# Altium schematic sheet [05] - TK2560_OutputLEDs.SchDoc
size A4; SheetNumber: 6; SheetTotal: 15
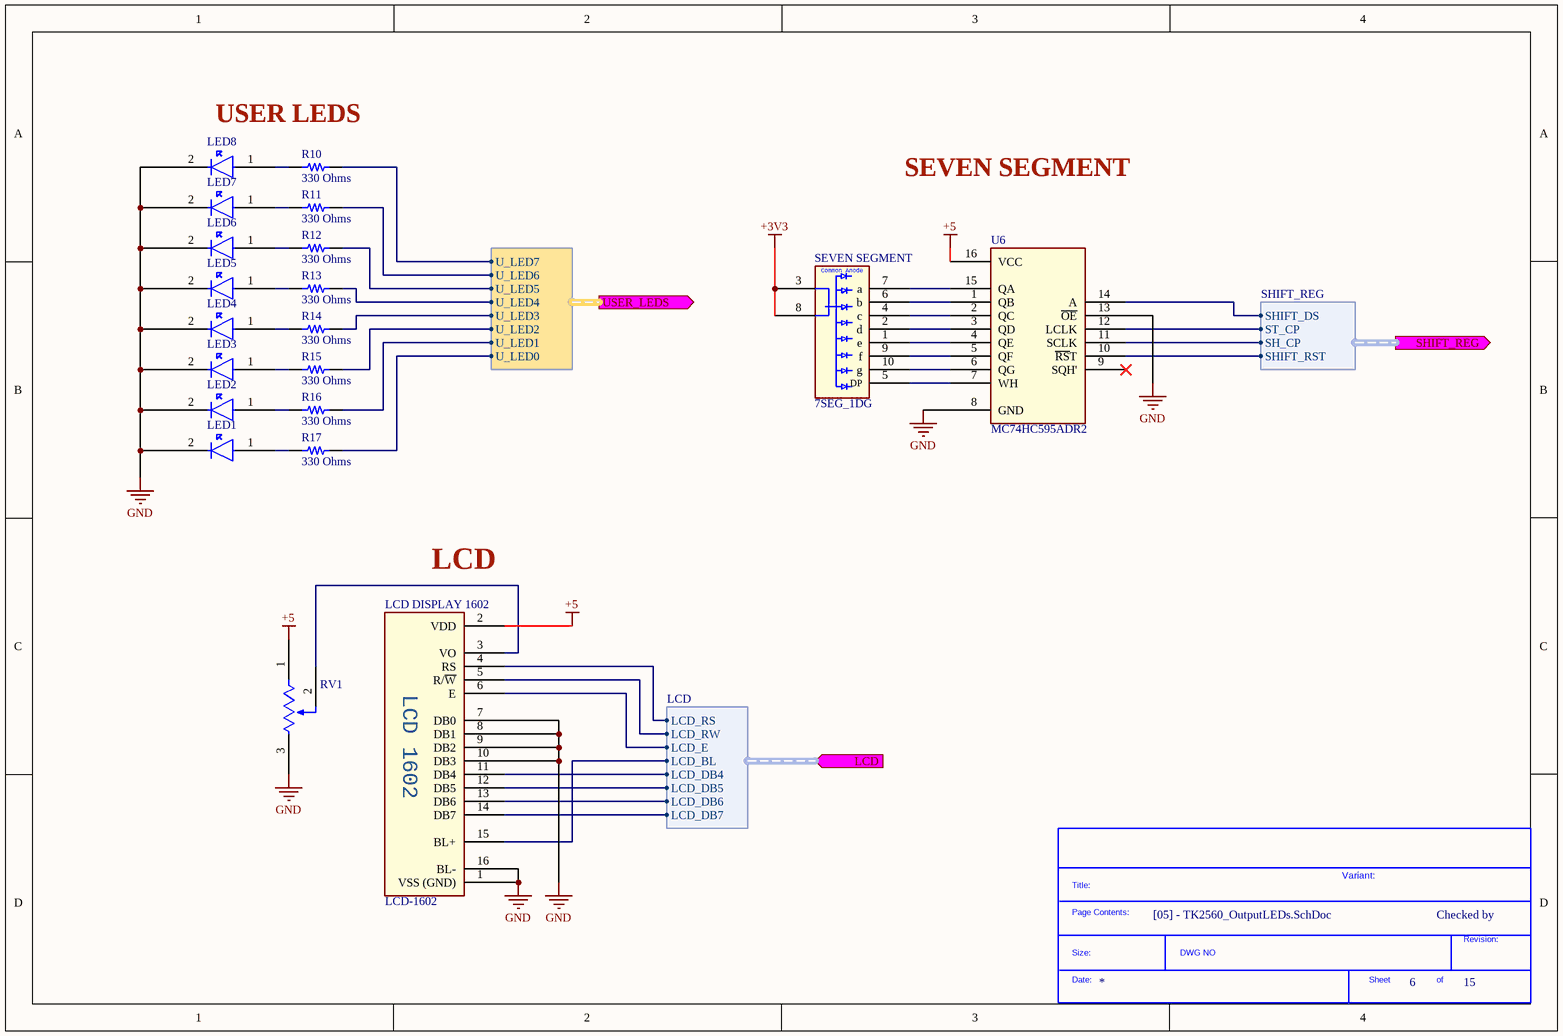
[diagram p0: [05] - TK2560_OutputLEDs.SchDoc]

## Parts
*?  SDTitleBlock  (value not drawn)  (graphical)
LCD_DISPLAY_1602  LCD-1602  [LCD1602]
LED1  LED_5mm  [LED_5mm]  (value not drawn)
LED2  LED_5mm  [LED_5mm]  (value not drawn)
LED3  LED_5mm  [LED_5mm]  (value not drawn)
LED4  LED_5mm  [LED_5mm]  (value not drawn)
LED5  LED_5mm  [LED_5mm]  (value not drawn)
LED6  LED_5mm  [LED_5mm]  (value not drawn)
LED7  LED_5mm  [LED_5mm]  (value not drawn)
LED8  LED_5mm  [LED_5mm]  (value not drawn)
R10  330 Ohms  [RES 0805_2012]
R11  330 Ohms  [RES 0805_2012]
R12  330 Ohms  [RES 0805_2012]
R13  330 Ohms  [RES 0805_2012]
R14  330 Ohms  [RES 0805_2012]
R15  330 Ohms  [RES 0805_2012]
R16  330 Ohms  [RES 0805_2012]
R17  330 Ohms  [RES 0805_2012]
RV1  3296W-10K_Trim_Pot  [3296W_TrimPot]  (value not drawn)
SEVEN_SEGMENT  7SEG_1DG  [7SEG_1DG]
U6  MC74HC595ADR2  [SOIC-16]

## Ports
LCD (in, harness LCD), SHIFT_REG (out, harness SHIFT_REG), USER_LEDS (out, harness USER_LEDS)

## Harnesses
LCD: LCD_RS, LCD_RW, LCD_E, LCD_BL, LCD_DB4, LCD_DB5, LCD_DB6, LCD_DB7
SHIFT_REG: SHIFT_RST, SH_CP, ST_CP, SHIFT_DS
USER_LEDS: U_LED0, U_LED1, U_LED2, U_LED3, U_LED4, U_LED5, U_LED6, U_LED7

## Nets
+3V3: SEVEN_SEGMENT.3 SEVEN_SEGMENT.8
+5: LCD_DISPLAY_1602.2(VDD) RV1.1 U6.16(VCC)
GND: LCD_DISPLAY_1602.1(VSS_(GND)) LCD_DISPLAY_1602.7(DB0) LCD_DISPLAY_1602.8(DB1) LCD_DISPLAY_1602.9(DB2) LCD_DISPLAY_1602.10(DB3) LCD_DISPLAY_1602.16(BL-) LED1.2 LED2.2 LED3.2 LED4.2 LED5.2 LED6.2 LED7.2 LED8.2 RV1.3 U6.8(GND) U6.13(~{OE})
NetLCD_DISPLAY_1602_3: LCD_DISPLAY_1602.3(VO) RV1.2
NetLCD_DISPLAY_1602_4: LCD_DISPLAY_1602.4(RS) ; port LCD.LCD_RS
NetLCD_DISPLAY_1602_5: LCD_DISPLAY_1602.5(R/~{W}) ; port LCD.LCD_RW
NetLCD_DISPLAY_1602_6: LCD_DISPLAY_1602.6(E) ; port LCD.LCD_E
NetLCD_DISPLAY_1602_11: LCD_DISPLAY_1602.11(DB4) ; port LCD.LCD_DB4
NetLCD_DISPLAY_1602_12: LCD_DISPLAY_1602.12(DB5) ; port LCD.LCD_DB5
NetLCD_DISPLAY_1602_13: LCD_DISPLAY_1602.13(DB6) ; port LCD.LCD_DB6
NetLCD_DISPLAY_1602_14: LCD_DISPLAY_1602.14(DB7) ; port LCD.LCD_DB7
NetLCD_DISPLAY_1602_15: LCD_DISPLAY_1602.15(BL+) ; port LCD.LCD_BL
NetLED1_1: LED1.1 R17.1
NetLED2_1: LED2.1 R16.1
NetLED3_1: LED3.1 R15.1
NetLED4_1: LED4.1 R14.1
NetLED5_1: LED5.1 R13.1
NetLED6_1: LED6.1 R12.1
NetLED7_1: LED7.1 R11.1
NetLED8_1: LED8.1 R10.1
NetR10_2: R10.2 ; port USER_LEDS.U_LED7
NetR11_2: R11.2 ; port USER_LEDS.U_LED6
NetR12_2: R12.2 ; port USER_LEDS.U_LED5
NetR13_2: R13.2 ; port USER_LEDS.U_LED4
NetR14_2: R14.2 ; port USER_LEDS.U_LED3
NetR15_2: R15.2 ; port USER_LEDS.U_LED2
NetR16_2: R16.2 ; port USER_LEDS.U_LED1
NetR17_2: R17.2 ; port USER_LEDS.U_LED0
NetSEVEN_SEGMENT_1: SEVEN_SEGMENT.1(e) U6.4(QE)
NetSEVEN_SEGMENT_2: SEVEN_SEGMENT.2(d) U6.3(QD)
NetSEVEN_SEGMENT_4: SEVEN_SEGMENT.4(c) U6.2(QC)
NetSEVEN_SEGMENT_5: SEVEN_SEGMENT.5(DP) U6.7(WH)
NetSEVEN_SEGMENT_6: SEVEN_SEGMENT.6(b) U6.1(QB)
NetSEVEN_SEGMENT_7: SEVEN_SEGMENT.7(a) U6.15(QA)
NetSEVEN_SEGMENT_9: SEVEN_SEGMENT.9(f) U6.5(QF)
NetSEVEN_SEGMENT_10: SEVEN_SEGMENT.10(g) U6.6(QG)
NetU6_10: U6.10(~{RS}T) ; port SHIFT_REG.SHIFT_RST
NetU6_11: U6.11(SCLK) ; port SHIFT_REG.SH_CP
NetU6_12: U6.12(LCLK) ; port SHIFT_REG.ST_CP
NetU6_14: U6.14(A) ; port SHIFT_REG.SHIFT_DS

Not connected (* = marked no-connect by the designer): U6 9(SQH')*

## Notes on the sheet
- USER LEDS
- SEVEN SEGMENT
- (near LCD_DISPLAY_1602) LCD
- Variant:
- Checked by
- (in symbol LCD-1602) LCD 1602
- (in symbol SDTitleBlock) Title:; Page Contents:; Revision:; Size:; DWG NO; Date:; Sheet; of

## Library data of the parts
LCD_DISPLAY_1602 = LCD-1602: LUMEX         LCM-S01602DTR/C             Alphanumeric LCD, 16 x 2, Black on Grey, 5V, Parallel, English, Japanese, Reflective; Number of Characters: 32; Character Height: 5.56mm; Character Width: 2.96mm; Background Color: Green; Number Of Characters Per Row: 16; Current Rating: 3mA; Viewing Area (width): 66mm; Viewing Area (height): 16mm; Supplier 1: Digi-Key; Manufacturer: Lumex; Manufacturer Part Number: LCM-S01602DTR/C; RoHS: Yes; Category: LCD, OLED, Graphic Displays; Stock 1: 70; Pricing 1: 1=11.49000, 10=8.33200, 100=6.88450, 500=6.02938, 1000=5.70050, 2000=5.56895, 5000=5.48125, 10000=5.37163 (USD); Case/Package: Module; Min Operating Temperature: 0°C; Max Operating Temperature: 50°C; Interface: Parallel; Operating Supply Voltage: 5V; Packaging: Bulk; Package Quantity: 45; Voltage Rating: 5V; Length: 85mm; Width: 85mm; Height: 30mm; REACH SVHC: No SVHC; Lead Free: Lead Free; ComponentLink1URL: https://datasheet.ciiva.com/1314/1701289-1314455.pdf?src-supplier=Newark; ComponentLink1Description: https://datasheet.ciiva.com/1314/1701289-1314455.pdf?src-supplier=Newark; ComponentLink2URL: https://datasheet.ciiva.com/1227/1701289-1227260.pdf?src-supplier=Element14; ComponentLink2Description: https://datasheet.ciiva.com/1227/1701289-1227260.pdf?src-supplier=Element14; Supplier Part Number 1: 67-1780-ND
LED1-LED8 = LED_5mm: 5MM LED; Manufacturer: Kingbright; Manufacturer Part Number: WP7113ND; Stock 1: 50; Pricing 1: 1=0.67000, 10=0.41100, 100=0.23650, 1000=0.18508, 2000=0.16966, 5000=0.15423, 10000=0.14395, 25000=0.13881 (USD); Supplier 1: Digi-Key; Supplier Part Number 1: 754-1896-ND; ComponentLink1Description: Datasheet; ComponentLink1URL: https://www.kingbrightusa.com/images/catalog/SPEC/WP7113ND.pdf
R10-R17 = RC0805FR-07330RL: RES SMD 330 OHM 1% 1/8W 0805; Manufacturer: Yageo; Power (Watts): 0.125W, 1/8W; Temperature Coefficient: ±100ppm/°C; Part Number: RC0805FR-07330RL; Value: 330 Ohms; ComponentLink1Description: Datasheet; ComponentLink1URL: https://www.yageo.com/upload/media/product/productsearch/datasheet/rchip/PYu-RC_Group_51_RoHS_L_10.pdf; ComponentLink2Description: DigiKey Link; ComponentLink2URL: http://digikey.com/product-detail/en/yageo/RC0805FR-07330RL/311-330CRCT-ND/730813; Composition: Thick Film; Device Package: 0805 (2012 Metric); Features: Moisture Resistant; Height - Seated (Max): 0.024" (0.60mm); LastUpdated: 02/09/2020 01:15:14; Lifecycle Status: Active; Minimum Order: 1; Number of Terminations: 2; Operating Temperature: -55°C ~ 155°C; Package / Case: 0805 (2012 Metric); Packaging: CutTape; PartId: 32600; Part Status: Active; Price: 0.10; Resistance: 330 Ohms; Series: RC; Size / Dimension: 0.079" L x 0.049" W (2.00mm x 1.25mm); Supplier 1: DigiKey; Supplier Part Number 1: 311-330CRCT-ND; Supplier Device Package: 0805; Tolerance: ±1%
RV1 = 3296W-10K_Trim_Pot: TRIMMER 10K OHM 0.5W PC PIN TOP; Manufacturer: Bourns; Manufacturer Part Number: 3296W-1-103; Tolerance: 10%; Power Rating: 500mW; Resistance: 10kR; Number of Turns: 25; Temperature Coefficient: 100ppm/°C; Voltage Rating (DC): 500V; RoHS: No; Category: Variable Resistors and Potentiometers; Stock 1: 58; Pricing 1: 1=4.38000, 10=3.83600, 25=3.42520, 50=3.21960, 100=3.15100, 250=3.01400, 500=2.46600, 1000=2.12350, 5000=1.91800 (USD); Mount: PCB,Through Hole; Weight: 0.03oz; Color: Blue; Contact Plating: Tin,Lead; Min Operating Temperature: -55°C; Max Operating Temperature: 125°C; Package Quantity: 50; Packaging: Rail/Tube; Termination: Pin; Resistor Type: Cermet; Max Power Dissipation: 500mW; Taper: Linear; Series: Trimpot® 3296 - Sealed; Technology: CERMET; Resistance Tolerance: 10%; Length: 9.53mm; Width: 9.53mm; Height: 0.395inch; Depth: 4.83mm; Thickness: 5.59mm; Radiation Hardening: No; REACH SVHC: No SVHC; Military Standard: Not; RoHS Compliant: No; ComponentLink1URL: https://datasheet.ciiva.com/3266/3296-3266186.pdf?src-supplier=Avnet; ComponentLink1Description: https://datasheet.ciiva.com/3266/3296-3266186.pdf?src-supplier=Avnet; ComponentLink2URL: https://datasheet.ciiva.com/2164/3296-2164077.pdf?src-supplier=Digi-Key; ComponentLink2Description: https://datasheet.ciiva.com/2164/3296-2164077.pdf?src-supplier=Digi-Key; ComponentLink3URL: https://datasheet.ciiva.com/1570/1815117-1570414.pdf?src-supplier=Newark; ComponentLink3Description: https://datasheet.ciiva.com/1570/1815117-1570414.pdf?src-supplier=Newark; Supplier Part Number 1: 3296W-103-ND
SEVEN_SEGMENT = 7SEG_1DG: LED Displays & Accessories Single Red 640nm Common Anode; Manufacturer: Kingbright; Manufacturer Part Number: SA05-11SRWA; Character Height: 12.7mm; Character Width: 7.3mm; Max Power Dissipation: 75mW; Forward Current: 20mA; Forward Voltage: 1.85V; Number of Characters: 1; Luminous Intensity: 34mcd; Number of Segments: 7; Display Type: Segment; RoHS: Yes; Category: LED Displays; Stock 1: 1638; Pricing 1: 1=1.96000, 10=1.24000, 100=0.91770, 500=0.84334, 1000=0.69451, 2000=0.65979, 5000=0.64490, 10000=0.63180 (USD); Mount: Through Hole; Case/Package: DIP; Number of Pins: 10; Color: Red; Min Operating Temperature: -40°C; Max Operating Temperature: 85°C; Package Quantity: 40; Element Configuration: Common Anode; Illumination Color: Red; Operating Supply Voltage: 1.85V; Wavelength: 640nm; Packaging: Bulk; Power Consumption: 75mW; Test Current: 20mA; Length: 0.75inch; Width: 0.5inch; Height: 0.748inch; Lead Free: Lead Free; RoHS Compliant: Yes; ComponentLink1URL: https://datasheet.ciiva.com/16484/sa05-11srwa-16484660.pdf?src-supplier=Future+Electronics; ComponentLink1Description: https://datasheet.ciiva.com/16484/sa05-11srwa-16484660.pdf?src-supplier=Future+Electronics; ComponentLink2URL: https://datasheet.ciiva.com/11771/0900766b802001c1-11771105.pdf?src-supplier=RSComponents; ComponentLink2Description: https://datasheet.ciiva.com/11771/0900766b802001c1-11771105.pdf?src-supplier=RSComponents; ComponentLink3URL: https://datasheet.ciiva.com/2104/sa05-11srwa-2104885.pdf?src-supplier=Digi-Key; ComponentLink3Description: https://datasheet.ciiva.com/2104/sa05-11srwa-2104885.pdf?src-supplier=Digi-Key; ComponentLink4URL: https://datasheet.ciiva.com/4421/sa05-11srwa-42646-4421784.pdf?src-supplier=Mouser; ComponentLink4Description: https://datasheet.ciiva.com/4421/sa05-11srwa-42646-4421784.pdf?src-supplier=Mouser; ComponentLink5URL: https://datasheet.ciiva.com/26291/sa05-11srwa-26291690.pdf?src-supplier=Digi-Key; ComponentLink5Description: https://datasheet.ciiva.com/26291/sa05-11srwa-26291690.pdf?src-supplier=Digi-Key; Supplier 1: Digi-Key; Supplier Part Number 1: 754-1677-5-ND
U6 = MC74HC595ADR2: IC SHIFT REGISTR 8BIT 3ST 16SOIC; Manufacturer: ON Semiconductor; Propagation Delay: 24ns; Max Supply Voltage: 6V; Number of Elements: 1; Number of Circuits: 2; Number of Input Lines: 3; Logic Function: Shift Register; Number of Bits per Element: 8; Output Type: 3-STATE; Manufacturer Part Number: MC74HC595ADR2; RoHS: No; Category: Shift Registers; Mount: Surface Mount; Case/Package: SOIC; Number of Pins: 16; Min Operating Temperature: -55°C; Max Operating Temperature: 125°C; Packaging: Tape and Reel; Package Quantity: 1; Number of Output Lines: 3; Number of Bits: 8; Voltage: 6V; Series: 74HC; Lead Free: Contains Lead; RoHS Compliant: No; ComponentLink1URL: https://datasheet.ciiva.com/1887/mc74hc595a-d-1887894.pdf?src-supplier=Digi-Key; ComponentLink1Description: https://datasheet.ciiva.com/1887/mc74hc595a-d-1887894.pdf?src-supplier=Digi-Key; ComponentLink2URL: https://datasheet.ciiva.com/1887/mc74hc595a-d-1887895.pdf?src-supplier=Digi-Key; ComponentLink2Description: https://datasheet.ciiva.com/1887/mc74hc595a-d-1887895.pdf?src-supplier=Digi-Key; Supplier 1: Digi-Key; Supplier Part Number 1: MC74HC595ADR2OSCT-ND